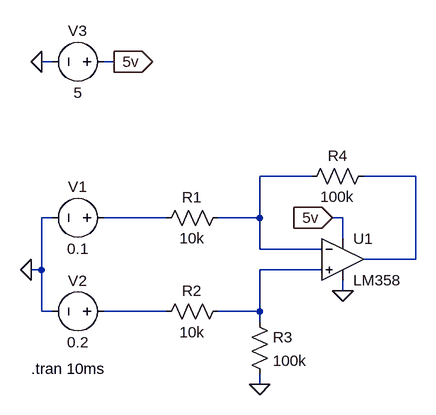
[diagram p0: schematic Amplificador Operacional Diferenciador.asc]
Amplificador Operacional Diferenciador.asc, the LTspice schematic file:
Version 4
SHEET 1 880 680
WIRE -96 -144 -112 -144
WIRE 0 -144 -16 -144
WIRE 304 32 224 32
WIRE 464 32 384 32
WIRE -96 96 -112 96
WIRE 80 96 -16 96
WIRE 224 96 224 32
WIRE 224 96 160 96
WIRE 352 96 336 96
WIRE 352 128 352 96
WIRE 224 144 224 96
WIRE 320 144 224 144
WIRE 464 160 464 32
WIRE 464 160 384 160
WIRE -112 176 -112 96
WIRE -112 176 -128 176
WIRE 320 176 224 176
WIRE 352 208 352 192
WIRE -112 240 -112 176
WIRE -96 240 -112 240
WIRE 80 240 -16 240
WIRE 224 240 224 176
WIRE 224 240 160 240
WIRE 224 256 224 240
WIRE 224 352 224 336
FLAG -128 176 0
FLAG 224 352 0
FLAG 352 208 0
FLAG 0 -144 5v
IOPIN 0 -144 Out
FLAG -112 -144 0
FLAG 336 96 5v
IOPIN 336 96 In
SYMBOL voltage 0 96 R90
WINDOW 0 -32 56 VBottom 2
WINDOW 3 32 56 VTop 2
SYMATTR InstName V1
SYMATTR Value 0.1
SYMBOL voltage 0 240 R90
WINDOW 0 -32 56 VBottom 2
WINDOW 3 32 56 VTop 2
WINDOW 123 0 0 Left 0
WINDOW 39 0 0 Left 0
SYMATTR InstName V2
SYMATTR Value 0.2
SYMBOL res 176 80 R90
WINDOW 0 0 56 VBottom 2
WINDOW 3 32 56 VTop 2
SYMATTR InstName R1
SYMATTR Value 10k
SYMBOL res 176 224 R90
WINDOW 0 0 56 VBottom 2
WINDOW 3 32 56 VTop 2
SYMATTR InstName R2
SYMATTR Value 10k
SYMBOL res 208 240 R0
SYMATTR InstName R3
SYMATTR Value 100k
SYMBOL ZZZ\\OpAmp\\LM358 352 160 R0
SYMATTR InstName U1
SYMBOL res 400 16 R90
WINDOW 0 0 56 VBottom 2
WINDOW 3 32 56 VTop 2
SYMATTR InstName R4
SYMATTR Value 100k
SYMBOL voltage 0 -144 R90
WINDOW 0 -32 56 VBottom 2
WINDOW 3 32 56 VTop 2
WINDOW 123 0 0 Left 0
WINDOW 39 0 0 Left 0
SYMATTR InstName V3
SYMATTR Value 5
TEXT -128 328 Left 2 !.tran 10ms

The netlist it stands for:
* Amplificador Operacional Diferenciador.asc
V1 N003 0 0.1
V2 N005 0 0.2
R1 N001 N003 10k
R2 N004 N005 10k
R3 N004 0 100k
XU1 N004 N001 5v 0 N002 LM358  ; pins In+ In- V+ V- OUT
R4 N002 N001 100k
V3 5v 0 5
.tran 10ms
.backanno
.end